# Altium schematic sheet Prog_Adaptor.SchDoc: Programming Adaptor
size A4
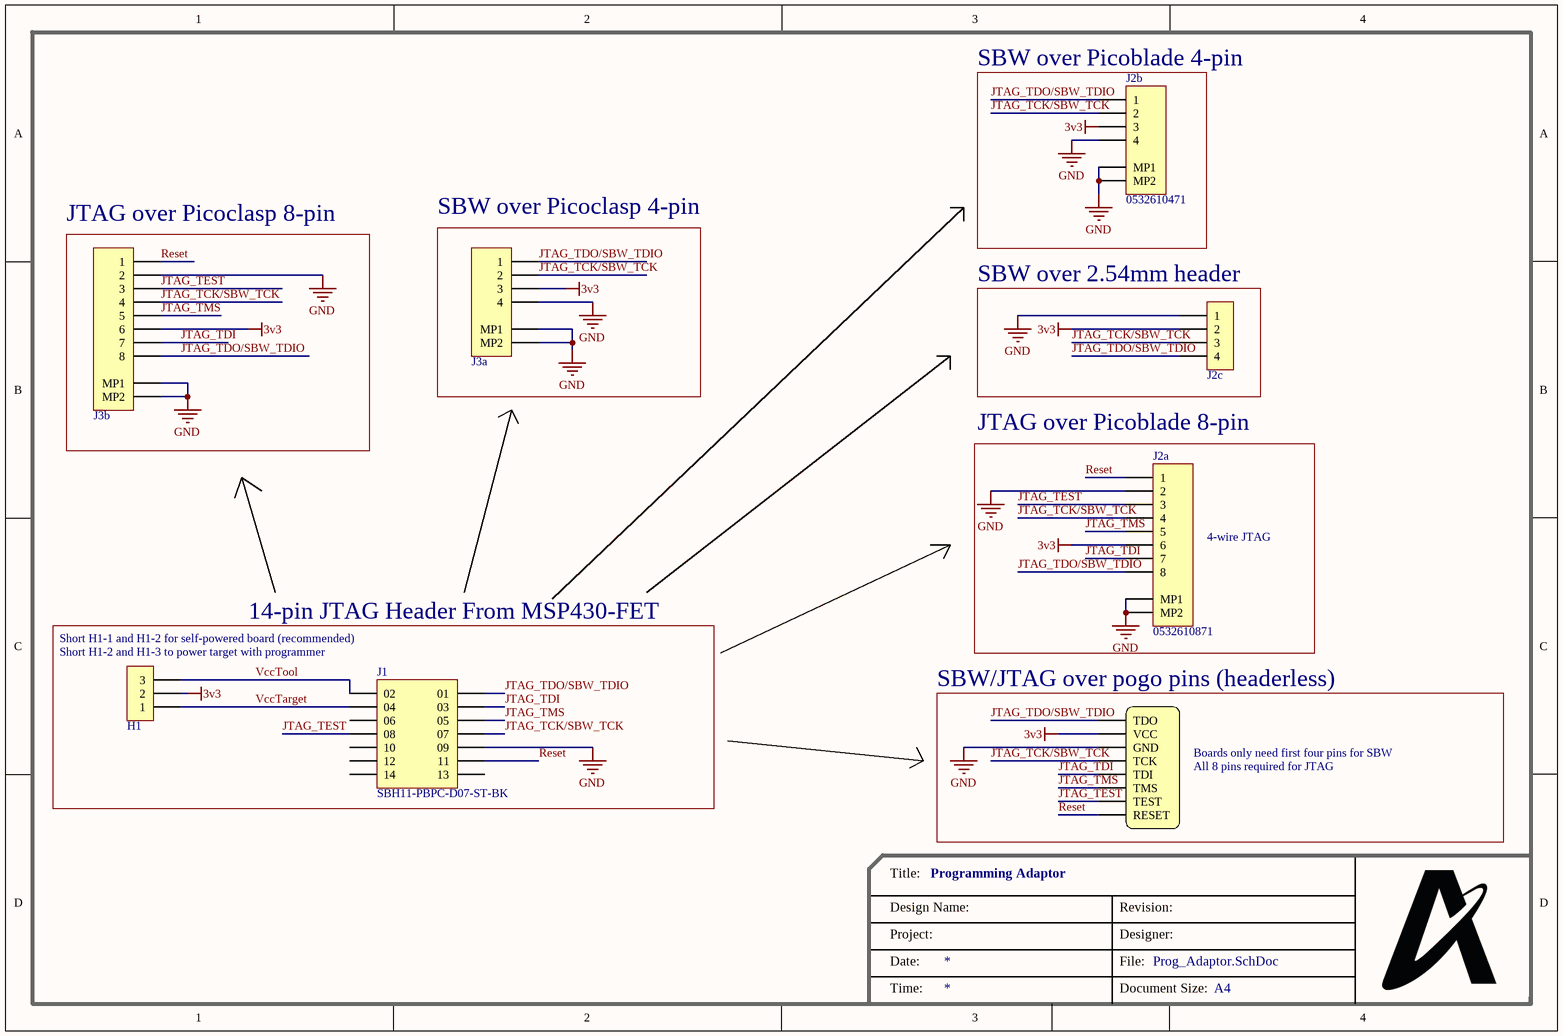
[diagram p0: Prog_Adaptor.SchDoc]

## Parts
H1  HDR,2.54mm,1x3  [HEADER_2.54MM_1x3PIN]  (value not drawn)  (no BOM)
J1  SBH11-PBPC-D07-ST-BK  [SBH11-PBPC-D07-ST-BK]
J2a  0532610871  [MOLEX_0532610871]
J2b  0532610471  [MOLEX_0532610471]
J2c  HDR,2.54mm,1x4  [HEADER_2.54MM_1x4PIN]  (value not drawn)  (no BOM)
J2d  Headerless Pogo Holes 8-pin  [POGO_8_PIN_HEADER]  (value not drawn)  (no BOM)
J3a  5015680407  [MOLEX_5015680407]  (value not drawn)
J3b  5015680807  [MOLEX_5015680807]  (value not drawn)

## Blocks framed on the sheet
SBW over Picoblade 4-pin: J2b
JTAG over Picoclasp 8-pin: J3b
SBW over Picoclasp 4-pin: J3a
SBW over 2.54mm header: J2c
JTAG over Picoblade 8-pin: J2a
14-pin JTAG Header From MSP430-FET: H1 J1
SBW/JTAG over pogo pins (headerless): J2d

## Nets
3v3: H1.2 J2a.6 J2b.3 J2c.2 J2d.2(VCC) J3a.3 J3b.6
GND: J1.09 J2a.2 J2a.MP1 J2a.MP2 J2b.4 J2b.MP1 J2b.MP2 J2c.1 J2d.3(GND) J3a.4 J3a.MP1 J3a.MP2 J3b.2 J3b.MP1 J3b.MP2
JTAG_TCK/SBW_TCK: J1.07 J2a.4 J2b.2 J2c.3 J2d.4(TCK) J3a.2 J3b.4
JTAG_TDI: J1.03 J2a.7 J2d.5(TDI) J3b.7
JTAG_TDO/SBW_TDIO: J1.01 J2a.8 J2b.1 J2c.4 J2d.1(TDO) J3a.1 J3b.8
JTAG_TEST: J1.08 J2a.3 J2d.7(TEST) J3b.3
JTAG_TMS: J1.05 J2a.5 J2d.6(TMS) J3b.5
Reset: J1.11 J2a.1 J2d.8(RESET) J3b.1
VccTarget: H1.1 J1.04
VccTool: H1.3 J1.02

Not connected (* = marked no-connect by the designer): J1 06 10 12 13 14

## Notes on the sheet
- 4-wire JTAG
- (near H1) Short H1-2 and H1-3 to power target with programmer
- Short H1-1 and H1-2 for self-powered board (recommended)
- All 8 pins required for JTAG
- Boards only need first four pins for SBW
- Title:
- Design Name:
- Revision:
- Project:
- Date:
- Designer:
- File:
- Time:
- Document Size:
- A4

## Library data of the parts
H1 = HDR,2.54mm,1x3: Connector - 2.54mm, 1x3-pin
J1 = SBH11-PBPC-D07-ST-BK: 14-pin JTAG Male Header
J2a = 0532610871: Header - Picoblade 08-pin, SMT, RA; Pitch: 1.25mm; Mounting Type: Surface Mount; Orientation: Right Angle; Pins: 8; Supplier 1: Digikey; Supplier 1 Part No.: WM7626CT-ND; MF Part No.: 0532610871
J2b = 0532610471: Header - Picoblade 04-pin, SMT, RA; Pitch: 1.25mm; Mounting Type: Surface Mount; Orientation: Right Angle; Pins: 4; Supplier 1: Digikey; Supplier 1 Part No.: WM7622CT-ND; MF Part No.: 0532610471
J2c = HDR,2.54mm,1x4: Connector - 2.54mm, 1x4-pin
J2d = Headerless Pogo Holes 8-pin: Connector - Pogo pin pads, JTAG
J3a = 5015680407: Connector - Picoclasp  04-pin, SMT, RA; APSS Standard Part: APSS Standard; Pitch: 1mm; Mounting Type: Surface Mount; Orientation: Straight; MF Part No.: 5015680407; Pins: 4; Supplier 1: Digikey; Supplier 1 Part No.: WM7895CT-ND
J3b = 5015680807: Connector - Picoclasp  08-pin, SMT, RA; APSS Standard Part: APSS Standard; Pitch: 1mm; Mounting Type: Surface Mount; Orientation: Straight; MF Part No.: 5015680807; Pins: 8; Supplier 1: Digikey